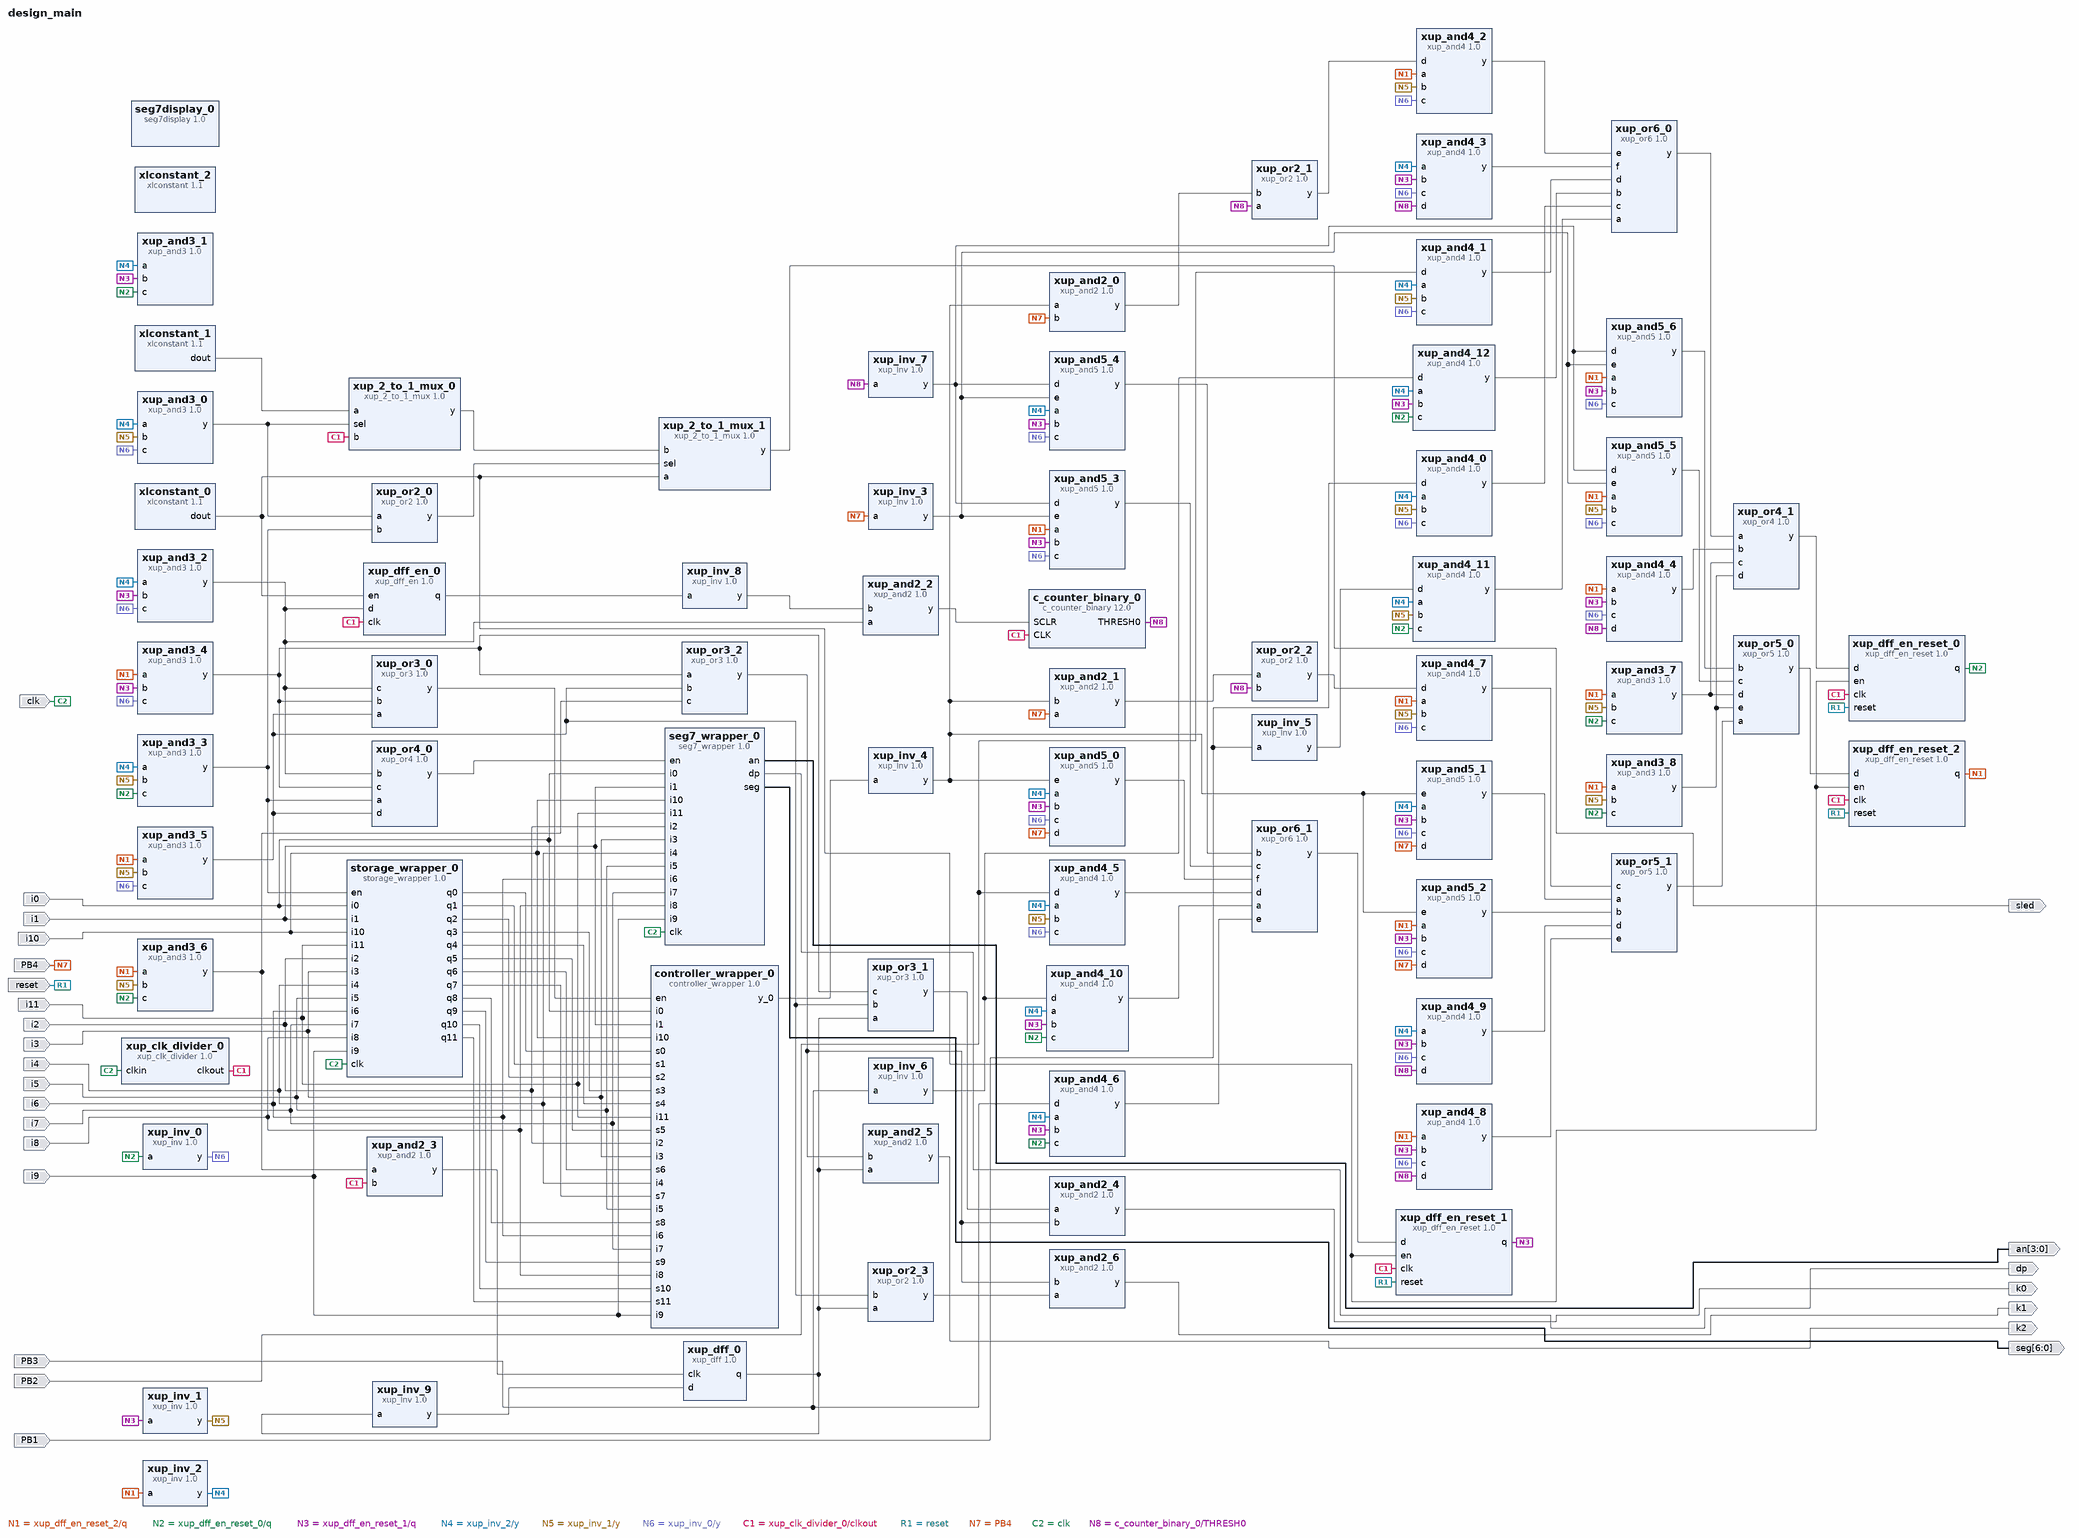
[diagram p0: block diagram of the top level]
# Vivado block design design_main, xc7a35tcpg236-1, Vivado 2018.1
create_bd_design design_main

create_bd_port -dir O sled
create_bd_port -dir I reset
create_bd_port -dir I PB4
create_bd_port -dir I PB3
create_bd_port -dir I PB2
create_bd_port -dir I PB1
create_bd_port -dir I clk
create_bd_port -dir O -from 3 -to 0 an
create_bd_port -dir O dp
create_bd_port -dir O -from 6 -to 0 seg
create_bd_port -dir I i0
create_bd_port -dir I i1
create_bd_port -dir I i10
create_bd_port -dir I i11
create_bd_port -dir I i2
create_bd_port -dir I i3
create_bd_port -dir I i4
create_bd_port -dir I i5
create_bd_port -dir I i6
create_bd_port -dir I i7
create_bd_port -dir I i8
create_bd_port -dir I i9
create_bd_port -dir O k0
create_bd_port -dir O k1
create_bd_port -dir O k2

create_bd_cell -type ip -vlnv xilinx.com:XUP:xup_dff_en_reset:1.0 xup_dff_en_reset_0
create_bd_cell -type ip -vlnv xilinx.com:XUP:xup_dff_en_reset:1.0 xup_dff_en_reset_1
create_bd_cell -type ip -vlnv xilinx.com:XUP:xup_dff_en_reset:1.0 xup_dff_en_reset_2
create_bd_cell -type ip -vlnv xilinx.com:XUP:xup_inv:1.0 xup_inv_0
create_bd_cell -type ip -vlnv xilinx.com:XUP:xup_inv:1.0 xup_inv_1
create_bd_cell -type ip -vlnv xilinx.com:XUP:xup_inv:1.0 xup_inv_2
create_bd_cell -type ip -vlnv xilinx.com:XUP:xup_clk_divider:1.0 xup_clk_divider_0
set_property -dict {CONFIG.SIZE 100000000} [get_bd_cells xup_clk_divider_0]
create_bd_cell -type ip -vlnv xilinx.com:ip:xlconstant:1.1 xlconstant_0
create_bd_cell -type ip -vlnv xilinx.com:XUP:xup_2_to_1_mux:1.0 xup_2_to_1_mux_0
create_bd_cell -type ip -vlnv xilinx.com:XUP:xup_2_to_1_mux:1.0 xup_2_to_1_mux_1
create_bd_cell -type ip -vlnv xilinx.com:ip:xlconstant:1.1 xlconstant_1
set_property -dict {CONFIG.CONST_VAL 0} [get_bd_cells xlconstant_1]
create_bd_cell -type ip -vlnv xilinx.com:XUP:xup_and3:1.0 xup_and3_0
create_bd_cell -type ip -vlnv xilinx.com:XUP:xup_and3:1.0 xup_and3_1
create_bd_cell -type ip -vlnv xilinx.com:XUP:xup_and3:1.0 xup_and3_2
create_bd_cell -type ip -vlnv xilinx.com:XUP:xup_and3:1.0 xup_and3_3
create_bd_cell -type ip -vlnv xilinx.com:XUP:xup_or2:1.0 xup_or2_0
create_bd_cell -type ip -vlnv xilinx.com:ip:c_counter_binary:12.0 c_counter_binary_0
set_property -dict [list \
  CONFIG.Output_Width 6 \
  CONFIG.Restrict_Count true \
  CONFIG.Final_Count_Value 22 \
  CONFIG.Sync_Threshold_Output true \
  CONFIG.Threshold_Value 22 \
  CONFIG.CE false \
  CONFIG.SCLR true \
  CONFIG.Load false \
] [get_bd_cells c_counter_binary_0]
create_bd_cell -type ip -vlnv xilinx.com:XUP:xup_and3:1.0 xup_and3_4
create_bd_cell -type ip -vlnv xilinx.com:XUP:xup_and3:1.0 xup_and3_5
create_bd_cell -type ip -vlnv xilinx.com:XUP:xup_and3:1.0 xup_and3_6
create_bd_cell -type ip -vlnv xilinx.com:XUP:xup_or5:1.0 xup_or5_1
create_bd_cell -type ip -vlnv xilinx.com:XUP:xup_and4:1.0 xup_and4_0
create_bd_cell -type ip -vlnv xilinx.com:XUP:xup_and4:1.0 xup_and4_1
create_bd_cell -type ip -vlnv xilinx.com:XUP:xup_and4:1.0 xup_and4_2
create_bd_cell -type ip -vlnv xilinx.com:XUP:xup_and4:1.0 xup_and4_3
create_bd_cell -type ip -vlnv xilinx.com:XUP:xup_and4:1.0 xup_and4_4
create_bd_cell -type ip -vlnv xilinx.com:XUP:xup_or2:1.0 xup_or2_1
create_bd_cell -type ip -vlnv xilinx.com:XUP:xup_and2:1.0 xup_and2_0
create_bd_cell -type ip -vlnv xilinx.com:XUP:xup_inv:1.0 xup_inv_4
create_bd_cell -type ip -vlnv xilinx.com:XUP:xup_and4:1.0 xup_and4_5
create_bd_cell -type ip -vlnv xilinx.com:XUP:xup_and4:1.0 xup_and4_6
create_bd_cell -type ip -vlnv xilinx.com:XUP:xup_and5:1.0 xup_and5_0
create_bd_cell -type ip -vlnv xilinx.com:XUP:xup_and5:1.0 xup_and5_1
create_bd_cell -type ip -vlnv xilinx.com:XUP:xup_and5:1.0 xup_and5_2
create_bd_cell -type ip -vlnv xilinx.com:XUP:xup_and4:1.0 xup_and4_7
create_bd_cell -type ip -vlnv xilinx.com:XUP:xup_and4:1.0 xup_and4_8
create_bd_cell -type ip -vlnv xilinx.com:XUP:xup_and4:1.0 xup_and4_9
create_bd_cell -type ip -vlnv xilinx.com:XUP:xup_or2:1.0 xup_or2_2
create_bd_cell -type ip -vlnv xilinx.com:XUP:xup_and2:1.0 xup_and2_1
create_bd_cell -type ip -vlnv xilinx.com:XUP:xup_and4:1.0 xup_and4_11
create_bd_cell -type ip -vlnv xilinx.com:XUP:xup_and4:1.0 xup_and4_12
create_bd_cell -type ip -vlnv xilinx.com:XUP:xup_or6:1.0 xup_or6_0
create_bd_cell -type ip -vlnv xilinx.com:XUP:xup_inv:1.0 xup_inv_3
create_bd_cell -type ip -vlnv xilinx.com:XUP:xup_inv:1.0 xup_inv_5
create_bd_cell -type ip -vlnv xilinx.com:XUP:xup_inv:1.0 xup_inv_6
create_bd_cell -type ip -vlnv xilinx.com:XUP:xup_and5:1.0 xup_and5_3
create_bd_cell -type ip -vlnv xilinx.com:XUP:xup_and5:1.0 xup_and5_4
create_bd_cell -type ip -vlnv xilinx.com:XUP:xup_inv:1.0 xup_inv_7
create_bd_cell -type ip -vlnv xilinx.com:XUP:xup_and3:1.0 xup_and3_7
create_bd_cell -type ip -vlnv xilinx.com:XUP:xup_and5:1.0 xup_and5_5
create_bd_cell -type ip -vlnv xilinx.com:XUP:xup_or6:1.0 xup_or6_1
create_bd_cell -type ip -vlnv xilinx.com:XUP:xup_and4:1.0 xup_and4_10
create_bd_cell -type ip -vlnv xilinx.com:XUP:xup_and5:1.0 xup_and5_6
create_bd_cell -type ip -vlnv xilinx.com:XUP:xup_or4:1.0 xup_or4_1
create_bd_cell -type ip -vlnv xilinx.com:XUP:xup_and3:1.0 xup_and3_8
create_bd_cell -type ip -vlnv xilinx.com:XUP:xup_or5:1.0 xup_or5_0
create_bd_cell -type ip -vlnv xilinx.com:XUP:xup_dff_en:1.0 xup_dff_en_0
create_bd_cell -type ip -vlnv xilinx.com:XUP:xup_and2:1.0 xup_and2_2
create_bd_cell -type ip -vlnv xilinx.com:XUP:xup_inv:1.0 xup_inv_8
create_bd_cell -type ip -vlnv xilinx.com:user:storage_wrapper:1.0 storage_wrapper_0
create_bd_cell -type ip -vlnv xilinx.com:user:seg7_wrapper:1.0 seg7_wrapper_0
create_bd_cell -type ip -vlnv xilinx.com:user:controller_wrapper:1.0 controller_wrapper_0
create_bd_cell -type ip -vlnv xilinx.com:XUP:xup_or4:1.0 xup_or4_0
create_bd_cell -type ip -vlnv xilinx.com:XUP:xup_or3:1.0 xup_or3_0
create_bd_cell -type ip -vlnv xilinx.com:XUP:xup_or2:1.0 xup_or2_3
create_bd_cell -type ip -vlnv xilinx.com:XUP:xup_or3:1.0 xup_or3_1
create_bd_cell -type ip -vlnv xilinx.com:XUP:xup_dff:1.0 xup_dff_0
create_bd_cell -type ip -vlnv xilinx.com:XUP:xup_inv:1.0 xup_inv_9
create_bd_cell -type ip -vlnv xilinx.com:XUP:xup_and2:1.0 xup_and2_3
create_bd_cell -type ip -vlnv xilinx.com:XUP:xup_and2:1.0 xup_and2_4
create_bd_cell -type ip -vlnv xilinx.com:XUP:xup_and2:1.0 xup_and2_5
create_bd_cell -type ip -vlnv xilinx.com:XUP:xup_and2:1.0 xup_and2_6
create_bd_cell -type ip -vlnv xilinx.com:XUP:xup_or3:1.0 xup_or3_2
create_bd_cell -type ip -vlnv xilinx.com:ip:xlconstant:1.1 xlconstant_2
create_bd_cell -type ip -vlnv xilinx.com:XUP:seg7display:1.0 seg7display_0

# ---- connections ----

connect_bd_net [get_bd_pins xup_dff_en_reset_2/q] \
  [get_bd_pins xup_inv_2/a] [get_bd_pins xup_and3_4/a] [get_bd_pins xup_and3_5/a] [get_bd_pins xup_and3_6/a] \
  [get_bd_pins xup_and4_2/a] [get_bd_pins xup_and4_4/a] [get_bd_pins xup_and5_2/a] [get_bd_pins xup_and4_7/a] \
  [get_bd_pins xup_and4_8/a] [get_bd_pins xup_and5_3/a] [get_bd_pins xup_and3_7/a] [get_bd_pins xup_and5_5/a] \
  [get_bd_pins xup_and5_6/a] [get_bd_pins xup_and3_8/a]
connect_bd_net [get_bd_pins xup_dff_en_reset_0/q] \
  [get_bd_pins xup_inv_0/a] [get_bd_pins xup_and3_3/c] [get_bd_pins xup_and3_1/c] [get_bd_pins xup_and3_6/c] \
  [get_bd_pins xup_and4_6/c] [get_bd_pins xup_and4_11/c] [get_bd_pins xup_and4_12/c] [get_bd_pins xup_and3_7/c] \
  [get_bd_pins xup_and4_10/c] [get_bd_pins xup_and3_8/c]
connect_bd_net [get_bd_pins xup_dff_en_reset_1/q] \
  [get_bd_pins xup_inv_1/a] [get_bd_pins xup_and3_2/b] [get_bd_pins xup_and3_1/b] [get_bd_pins xup_and3_4/b] \
  [get_bd_pins xup_and4_3/b] [get_bd_pins xup_and4_4/b] [get_bd_pins xup_and4_6/b] [get_bd_pins xup_and5_0/b] \
  [get_bd_pins xup_and5_1/b] [get_bd_pins xup_and5_2/b] [get_bd_pins xup_and4_9/b] [get_bd_pins xup_and4_8/b] \
  [get_bd_pins xup_and4_12/b] [get_bd_pins xup_and5_4/b] [get_bd_pins xup_and5_3/b] [get_bd_pins xup_and4_10/b] \
  [get_bd_pins xup_and5_6/b]
connect_bd_net [get_bd_pins xup_inv_2/y] \
  [get_bd_pins xup_and3_0/a] [get_bd_pins xup_and3_3/a] [get_bd_pins xup_and3_2/a] [get_bd_pins xup_and3_1/a] \
  [get_bd_pins xup_and4_0/a] [get_bd_pins xup_and4_3/a] [get_bd_pins xup_and4_5/a] [get_bd_pins xup_and4_6/a] \
  [get_bd_pins xup_and5_0/a] [get_bd_pins xup_and5_1/a] [get_bd_pins xup_and4_9/a] [get_bd_pins xup_and4_1/a] \
  [get_bd_pins xup_and4_11/a] [get_bd_pins xup_and4_12/a] [get_bd_pins xup_and5_4/a] [get_bd_pins xup_and4_10/a]
connect_bd_net [get_bd_pins xup_inv_1/y] \
  [get_bd_pins xup_and3_0/b] [get_bd_pins xup_and3_3/b] [get_bd_pins xup_and3_5/b] [get_bd_pins xup_and3_6/b] \
  [get_bd_pins xup_and4_0/b] [get_bd_pins xup_and4_2/b] [get_bd_pins xup_and4_5/b] [get_bd_pins xup_and4_7/b] \
  [get_bd_pins xup_and4_1/b] [get_bd_pins xup_and4_11/b] [get_bd_pins xup_and3_7/b] [get_bd_pins xup_and5_5/b] \
  [get_bd_pins xup_and3_8/b]
connect_bd_net [get_bd_pins xup_inv_0/y] \
  [get_bd_pins xup_and3_0/c] [get_bd_pins xup_and3_2/c] [get_bd_pins xup_and3_4/c] [get_bd_pins xup_and3_5/c] \
  [get_bd_pins xup_and4_0/c] [get_bd_pins xup_and4_1/c] [get_bd_pins xup_and4_2/c] [get_bd_pins xup_and4_3/c] \
  [get_bd_pins xup_and4_4/c] [get_bd_pins xup_and4_5/c] [get_bd_pins xup_and5_0/c] [get_bd_pins xup_and5_1/c] \
  [get_bd_pins xup_and5_2/c] [get_bd_pins xup_and4_7/c] [get_bd_pins xup_and4_9/c] [get_bd_pins xup_and4_8/c] \
  [get_bd_pins xup_and5_4/c] [get_bd_pins xup_and5_3/c] [get_bd_pins xup_and5_5/c] [get_bd_pins xup_and5_6/c]
connect_bd_net [get_bd_pins xlconstant_0/dout] \
  [get_bd_pins xup_dff_en_reset_2/en] [get_bd_pins xup_dff_en_reset_1/en] [get_bd_pins xup_dff_en_reset_0/en] \
  [get_bd_pins xup_2_to_1_mux_1/a] [get_bd_pins xup_dff_en_0/en]
connect_bd_net [get_bd_pins xup_and3_0/y] [get_bd_pins xup_2_to_1_mux_0/sel] [get_bd_pins xup_or2_0/a]
connect_bd_net [get_bd_pins xup_clk_divider_0/clkout] \
  [get_bd_pins xup_2_to_1_mux_0/b] [get_bd_pins c_counter_binary_0/CLK] [get_bd_pins xup_dff_en_reset_2/clk] \
  [get_bd_pins xup_dff_en_reset_1/clk] [get_bd_pins xup_dff_en_reset_0/clk] [get_bd_pins xup_dff_en_0/clk] \
  [get_bd_pins xup_and2_3/b]
connect_bd_net [get_bd_pins xlconstant_1/dout] [get_bd_pins xup_2_to_1_mux_0/a]
connect_bd_net [get_bd_pins xup_2_to_1_mux_0/y] [get_bd_pins xup_2_to_1_mux_1/b]
connect_bd_net [get_bd_pins xup_and3_3/y] [get_bd_pins xup_or2_0/b] [get_bd_pins storage_wrapper_0/en] [get_bd_pins xup_or4_0/a]
connect_bd_net [get_bd_pins xup_or2_0/y] [get_bd_pins xup_2_to_1_mux_1/sel]
connect_bd_net [get_bd_pins xup_2_to_1_mux_1/y] [get_bd_ports sled]
connect_bd_net [get_bd_pins xup_inv_4/y] \
  [get_bd_pins xup_and2_0/a] [get_bd_pins xup_and5_0/e] [get_bd_pins xup_and5_1/e] [get_bd_pins xup_and5_2/e] \
  [get_bd_pins xup_and2_1/b]
connect_bd_net [get_bd_pins xup_and2_0/y] [get_bd_pins xup_or2_1/b]
connect_bd_net [get_bd_pins xup_or2_1/y] [get_bd_pins xup_and4_2/d]
connect_bd_net [get_bd_pins xup_and2_1/y] [get_bd_pins xup_or2_2/a]
connect_bd_net [get_bd_pins xup_or2_2/y] [get_bd_pins xup_and4_7/d]
connect_bd_net [get_bd_pins xup_and5_1/y] [get_bd_pins xup_or5_1/a]
connect_bd_net [get_bd_pins xup_and5_2/y] [get_bd_pins xup_or5_1/b]
connect_bd_net [get_bd_pins xup_and4_7/y] [get_bd_pins xup_or5_1/c]
connect_bd_net [get_bd_pins xup_and4_9/y] [get_bd_pins xup_or5_1/d]
connect_bd_net [get_bd_pins xup_and4_8/y] [get_bd_pins xup_or5_1/e]
connect_bd_net [get_bd_pins xup_and3_2/y] [get_bd_pins xup_and2_2/a] [get_bd_pins xup_dff_en_0/d] [get_bd_pins xup_or4_0/b] [get_bd_pins xup_or3_0/c]
connect_bd_net [get_bd_pins xup_and4_11/y] [get_bd_pins xup_or6_0/a]
connect_bd_net [get_bd_pins xup_and4_12/y] [get_bd_pins xup_or6_0/b]
connect_bd_net [get_bd_pins xup_and4_0/y] [get_bd_pins xup_or6_0/c]
connect_bd_net [get_bd_pins xup_and4_1/y] [get_bd_pins xup_or6_0/d]
connect_bd_net [get_bd_pins xup_and4_2/y] [get_bd_pins xup_or6_0/e]
connect_bd_net [get_bd_pins xup_and4_3/y] [get_bd_pins xup_or6_0/f]
connect_bd_net [get_bd_pins xup_inv_5/y] [get_bd_pins xup_and4_11/d]
connect_bd_net [get_bd_pins xup_inv_6/y] [get_bd_pins xup_and4_12/d] [get_bd_pins xup_and4_10/d]
connect_bd_net [get_bd_pins xup_inv_7/y] [get_bd_pins xup_and5_4/d] [get_bd_pins xup_and5_3/d] [get_bd_pins xup_and5_5/d] [get_bd_pins xup_and5_6/d]
connect_bd_net [get_bd_pins xup_inv_3/y] [get_bd_pins xup_and5_4/e] [get_bd_pins xup_and5_3/e] [get_bd_pins xup_and5_5/e] [get_bd_pins xup_and5_6/e]
connect_bd_net [get_bd_pins xup_and3_7/y] [get_bd_pins xup_or4_1/c] [get_bd_pins xup_or5_0/d]
connect_bd_net [get_bd_pins xup_and5_0/y] [get_bd_pins xup_or6_1/f]
connect_bd_net [get_bd_pins xup_and4_6/y] [get_bd_pins xup_or6_1/e]
connect_bd_net [get_bd_pins xup_and4_5/y] [get_bd_pins xup_or6_1/d]
connect_bd_net [get_bd_pins xup_and5_3/y] [get_bd_pins xup_or6_1/c]
connect_bd_net [get_bd_pins xup_and5_4/y] [get_bd_pins xup_or6_1/b]
connect_bd_net [get_bd_pins xup_and4_10/y] [get_bd_pins xup_or6_1/a]
connect_bd_net [get_bd_ports reset] \
  [get_bd_pins xup_dff_en_reset_2/reset] [get_bd_pins xup_dff_en_reset_1/reset] [get_bd_pins xup_dff_en_reset_0/reset]
connect_bd_net [get_bd_pins xup_or6_0/y] [get_bd_pins xup_or4_1/a]
connect_bd_net [get_bd_pins xup_and4_4/y] [get_bd_pins xup_or4_1/b]
connect_bd_net [get_bd_pins xup_and3_8/y] [get_bd_pins xup_or4_1/d] [get_bd_pins xup_or5_0/e]
connect_bd_net [get_bd_pins xup_or5_1/y] [get_bd_pins xup_or5_0/a]
connect_bd_net [get_bd_pins xup_and5_6/y] [get_bd_pins xup_or5_0/b]
connect_bd_net [get_bd_pins xup_and5_5/y] [get_bd_pins xup_or5_0/c]
connect_bd_net [get_bd_pins xup_or6_1/y] [get_bd_pins xup_dff_en_reset_1/d]
connect_bd_net [get_bd_pins xup_or4_1/y] [get_bd_pins xup_dff_en_reset_0/d]
connect_bd_net [get_bd_pins xup_or5_0/y] [get_bd_pins xup_dff_en_reset_2/d]
connect_bd_net -net PB4_1 [get_bd_ports PB4] \
  [get_bd_pins xup_inv_3/a] [get_bd_pins xup_and2_1/a] [get_bd_pins xup_and5_2/d] [get_bd_pins xup_and5_1/d] \
  [get_bd_pins xup_and5_0/d] [get_bd_pins xup_and2_0/b]
connect_bd_net -net PB3_1 [get_bd_ports PB3] [get_bd_pins xup_inv_6/a] [get_bd_pins xup_and4_6/d]
connect_bd_net -net PB2_1 [get_bd_ports PB2] [get_bd_pins xup_and4_5/d] [get_bd_pins xup_and4_1/d]
connect_bd_net -net PB1_1 [get_bd_ports PB1] [get_bd_pins xup_inv_5/a] [get_bd_pins xup_and4_0/d]
connect_bd_net [get_bd_ports clk] [get_bd_pins xup_clk_divider_0/clkin] [get_bd_pins storage_wrapper_0/clk] [get_bd_pins seg7_wrapper_0/clk]
connect_bd_net [get_bd_pins c_counter_binary_0/THRESH0] \
  [get_bd_pins xup_and4_4/d] [get_bd_pins xup_and4_3/d] [get_bd_pins xup_or2_1/a] [get_bd_pins xup_and4_9/d] \
  [get_bd_pins xup_and4_8/d] [get_bd_pins xup_or2_2/b] [get_bd_pins xup_inv_7/a]
connect_bd_net [get_bd_pins xup_and2_2/y] [get_bd_pins c_counter_binary_0/SCLR]
connect_bd_net [get_bd_pins xup_dff_en_0/q] [get_bd_pins xup_inv_8/a]
connect_bd_net [get_bd_pins xup_inv_8/y] [get_bd_pins xup_and2_2/b]
connect_bd_net [get_bd_pins storage_wrapper_0/q0] [get_bd_pins controller_wrapper_0/s0]
connect_bd_net [get_bd_pins storage_wrapper_0/q1] [get_bd_pins controller_wrapper_0/s1]
connect_bd_net [get_bd_pins storage_wrapper_0/q2] [get_bd_pins controller_wrapper_0/s2]
connect_bd_net [get_bd_pins storage_wrapper_0/q3] [get_bd_pins controller_wrapper_0/s3]
connect_bd_net [get_bd_pins storage_wrapper_0/q4] [get_bd_pins controller_wrapper_0/s4]
connect_bd_net [get_bd_pins storage_wrapper_0/q5] [get_bd_pins controller_wrapper_0/s5]
connect_bd_net [get_bd_pins storage_wrapper_0/q6] [get_bd_pins controller_wrapper_0/s6]
connect_bd_net [get_bd_pins storage_wrapper_0/q7] [get_bd_pins controller_wrapper_0/s7]
connect_bd_net [get_bd_pins storage_wrapper_0/q8] [get_bd_pins controller_wrapper_0/s8]
connect_bd_net [get_bd_pins storage_wrapper_0/q9] [get_bd_pins controller_wrapper_0/s9]
connect_bd_net [get_bd_pins storage_wrapper_0/q10] [get_bd_pins controller_wrapper_0/s10]
connect_bd_net [get_bd_pins storage_wrapper_0/q11] [get_bd_pins controller_wrapper_0/s11]
connect_bd_net [get_bd_pins seg7_wrapper_0/an] [get_bd_ports an]
connect_bd_net [get_bd_pins seg7_wrapper_0/dp] [get_bd_ports dp]
connect_bd_net [get_bd_pins seg7_wrapper_0/seg] [get_bd_ports seg]
connect_bd_net -net i0_0_1 [get_bd_ports i0] [get_bd_pins storage_wrapper_0/i0] [get_bd_pins controller_wrapper_0/i0] [get_bd_pins seg7_wrapper_0/i0]
connect_bd_net -net i1_0_1 [get_bd_ports i1] [get_bd_pins storage_wrapper_0/i1] [get_bd_pins controller_wrapper_0/i1] [get_bd_pins seg7_wrapper_0/i1]
connect_bd_net -net i10_0_1 [get_bd_ports i10] \
  [get_bd_pins storage_wrapper_0/i10] [get_bd_pins controller_wrapper_0/i10] [get_bd_pins seg7_wrapper_0/i10]
connect_bd_net -net i11_0_1 [get_bd_ports i11] \
  [get_bd_pins storage_wrapper_0/i11] [get_bd_pins controller_wrapper_0/i11] [get_bd_pins seg7_wrapper_0/i11]
connect_bd_net -net i2_0_1 [get_bd_ports i2] [get_bd_pins storage_wrapper_0/i2] [get_bd_pins controller_wrapper_0/i2] [get_bd_pins seg7_wrapper_0/i2]
connect_bd_net -net i3_0_1 [get_bd_ports i3] [get_bd_pins storage_wrapper_0/i3] [get_bd_pins controller_wrapper_0/i3] [get_bd_pins seg7_wrapper_0/i3]
connect_bd_net -net i4_0_1 [get_bd_ports i4] [get_bd_pins storage_wrapper_0/i4] [get_bd_pins controller_wrapper_0/i4] [get_bd_pins seg7_wrapper_0/i4]
connect_bd_net -net i5_0_1 [get_bd_ports i5] [get_bd_pins storage_wrapper_0/i5] [get_bd_pins controller_wrapper_0/i5] [get_bd_pins seg7_wrapper_0/i5]
connect_bd_net -net i6_0_1 [get_bd_ports i6] [get_bd_pins storage_wrapper_0/i6] [get_bd_pins controller_wrapper_0/i6] [get_bd_pins seg7_wrapper_0/i6]
connect_bd_net -net i7_0_1 [get_bd_ports i7] [get_bd_pins storage_wrapper_0/i7] [get_bd_pins controller_wrapper_0/i7] [get_bd_pins seg7_wrapper_0/i7]
connect_bd_net -net i8_0_1 [get_bd_ports i8] [get_bd_pins storage_wrapper_0/i8] [get_bd_pins controller_wrapper_0/i8] [get_bd_pins seg7_wrapper_0/i8]
connect_bd_net -net i9_0_1 [get_bd_ports i9] [get_bd_pins storage_wrapper_0/i9] [get_bd_pins controller_wrapper_0/i9] [get_bd_pins seg7_wrapper_0/i9]
connect_bd_net [get_bd_pins xup_and3_4/y] [get_bd_pins xup_or4_0/c] [get_bd_pins xup_or3_0/b] [get_bd_pins xup_or3_1/c] [get_bd_pins xup_or3_2/a]
connect_bd_net [get_bd_pins xup_and3_5/y] \
  [get_bd_pins xup_or4_0/d] [get_bd_pins xup_or3_0/a] [get_bd_pins xup_or3_1/b] [get_bd_pins xup_or2_3/b] \
  [get_bd_pins xup_or3_2/b]
connect_bd_net [get_bd_pins xup_or4_0/y] [get_bd_pins seg7_wrapper_0/en]
connect_bd_net [get_bd_pins xup_or3_0/y] [get_bd_pins controller_wrapper_0/en]
connect_bd_net [get_bd_pins controller_wrapper_0/y_0] [get_bd_pins xup_inv_4/a]
connect_bd_net [get_bd_pins xup_dff_0/q] [get_bd_pins xup_inv_9/a] [get_bd_pins xup_or2_3/a] [get_bd_pins xup_or3_1/a] [get_bd_pins xup_and2_5/a]
connect_bd_net [get_bd_pins xup_inv_9/y] [get_bd_pins xup_dff_0/d]
connect_bd_net [get_bd_pins xup_and2_3/y] [get_bd_pins xup_dff_0/clk]
connect_bd_net [get_bd_pins xup_and3_6/y] [get_bd_pins xup_and2_3/a] [get_bd_pins xup_or3_2/c]
connect_bd_net [get_bd_pins xup_or3_1/y] [get_bd_pins xup_and2_4/a]
connect_bd_net [get_bd_pins xup_and2_4/y] [get_bd_ports k0]
connect_bd_net [get_bd_pins xup_or2_3/y] [get_bd_pins xup_and2_6/a]
connect_bd_net [get_bd_pins xup_and2_6/y] [get_bd_ports k1]
connect_bd_net [get_bd_pins xup_and2_5/y] [get_bd_ports k2]
connect_bd_net [get_bd_pins xup_or3_2/y] [get_bd_pins xup_and2_4/b] [get_bd_pins xup_and2_6/b] [get_bd_pins xup_and2_5/b]

validate_bd_design
save_bd_design
